# Altium schematic sheet Main.SchDoc
size A; SheetNumber: 2; SheetTotal: 5
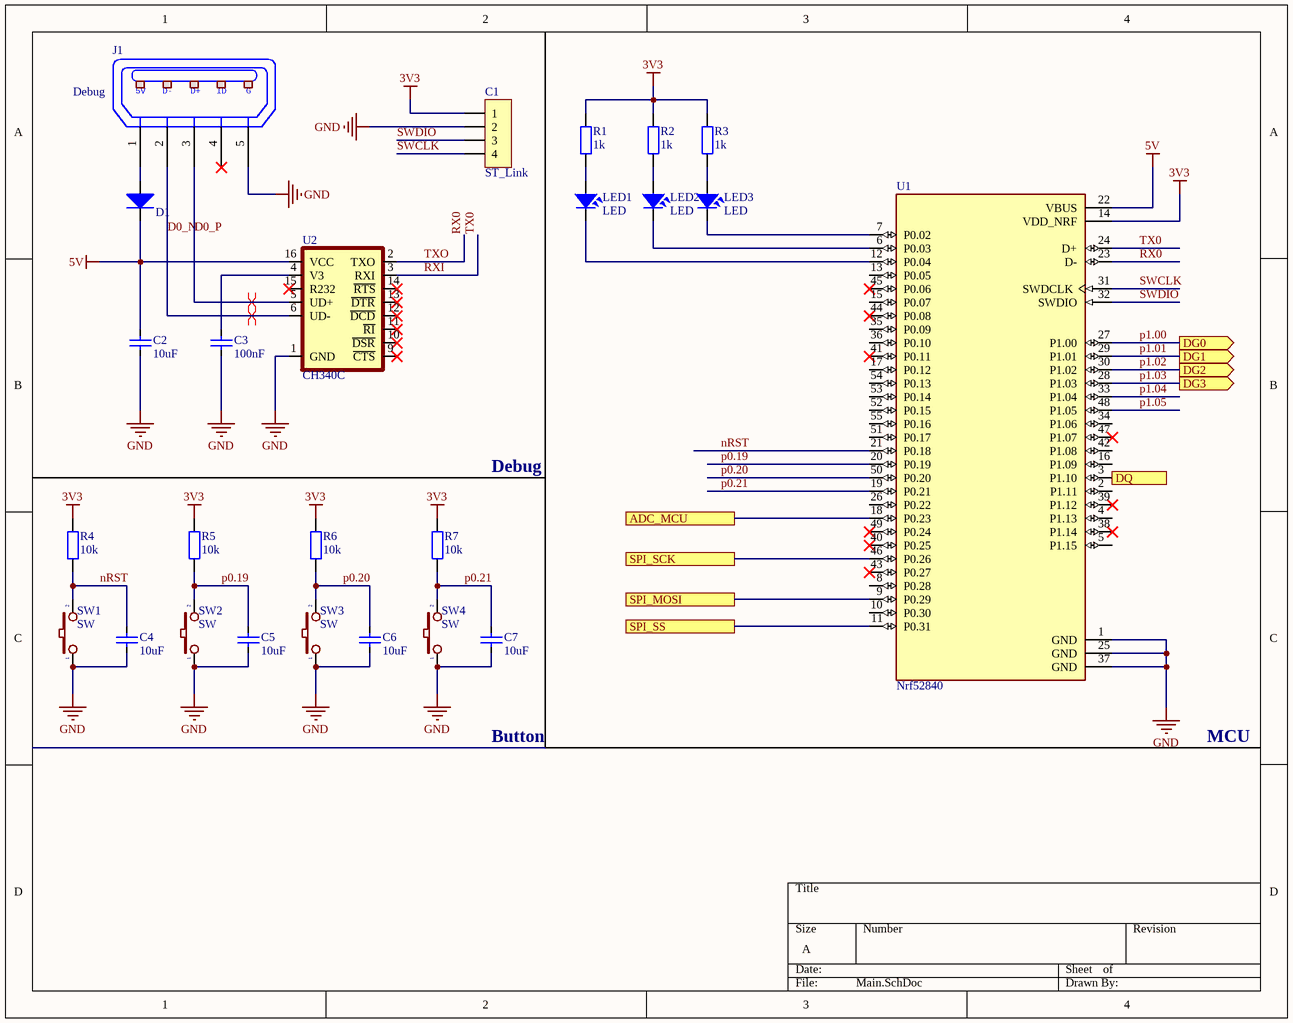
[diagram p0: Main.SchDoc]

## Parts
C1  ST_Link  [J4-D1T]
C2  10uF  [CAP_0805]
C3  100nF  [CAP_0805]
C4  10uF  [CAP_0805]
C5  10uF  [CAP_0805]
C6  10uF  [CAP_0805]
C7  10uF  [CAP_0805]
D1  Diode SMD  [DIO-214AC(SMA)]  (value not drawn)
J1  Debug  [USB-M1]
LED1  LED  [LED-0805-Red]
LED2  LED  [LED-0805-Yellow]
LED3  LED  [LED-0805-Green]
R1  1k  [RES-SMD-0805]
R2  1k  [RES-SMD-0805]
R3  1k  [RES-SMD-0805]
R4  10k  [RES-SMD-0805]
R5  10k  [RES-SMD-0805]
R6  10k  [RES-SMD-0805]
R7  10k  [RES-SMD-0805]
SW1  SW  [SW 3x2x4]
SW2  SW  [SW2]
SW3  SW  [SW2]
SW4  SW  [SW2]
U1  Nrf52840  [NRF52840]
U2  CH340C  [SOP-16]

## Ports
ADC_MCU, DG0 (out), DG1 (out), DG2 (out), DG3 (out), DQ, SPI_MOSI, SPI_SCK, SPI_SS

## Nets
3V3: C1.1 R1.1 R2.1 R3.1 R4.1 R5.1 R6.1 R7.1 U1.14(VDD_NRF)
5V: C2.2 D1.2(K) U1.22(VBUS) U2.16(VCC)
GND: C1.2 C2.1 C3.1 C4.1 C5.1 C6.1 C7.1 J1.5(P5) SW1.1 SW2.1 SW3.1 SW4.1 U1.1(GND) U1.25(GND) U1.37(GND) U2.1(GND)
ADC_MCU: U1.18(P0.23) ; port ADC_MCU
D0_N: J1.2(P2) U2.6(UD-)
D0_P: J1.3(P3) U2.5(UD+)
DQ: U1.3(P1.10) ; port DQ
nRST: C4.2 R4.2 SW1.2 U1.21(P0.18)
p0.19: C5.2 R5.2 SW2.2 U1.20(P0.19)
p0.20: C6.2 R6.2 SW3.2 U1.50(P0.20)
p0.21: C7.2 R7.2 SW4.2 U1.19(P0.21)
p1.00: U1.27(P1.00) ; port DG0
p1.01: U1.29(P1.01) ; port DG1
p1.02: U1.30(P1.02) ; port DG2
p1.03: U1.28(P1.03) ; port DG3
p1.04: U1.33(P1.04)
p1.05: U1.48(P1.05)
RX0: U1.23(D-) U2.2(TXO)  [also labelled TXO]
RXI: U1.24(D+) U2.3(RXI)  [also labelled TX0]
SPI_MOSI: U1.9(P0.29) ; port SPI_MOSI
SPI_SCK: U1.46(P0.26) ; port SPI_SCK
SPI_SS: U1.11(P0.31) ; port SPI_SS
SWCLK: C1.4 U1.31(SWDCLK)
SWDIO: C1.3 U1.32(SWDIO)
NetC3_2: C3.2 U2.4(V3)
NetD1_1: D1.1(A) J1.1(P1)
NetLED1_1: LED1.1 R1.2
NetLED1_2: LED1.2 U1.12(P0.04)
NetLED2_1: LED2.1 R2.2
NetLED2_2: LED2.2 U1.6(P0.03)
NetLED3_1: LED3.1 R3.2
NetLED3_2: LED3.2 U1.7(P0.02)

Not connected (* = marked no-connect by the designer): J1 4(P4)*; U1 2(P1.11) 4(P1.13) 5(P1.15) 8(P0.28) 10(P0.30) 13(P0.05) 15(P0.07) 16(P1.09) 17(P0.12) 26(P0.22) 34(P1.06) 35(P0.09) 36(P0.10) 38(P1.14)* 39(P1.12)* 40(P0.25)* 41(P0.11)* 42(P1.08) 43(P0.27)* 44(P0.08)* 45(P0.06)* 47(P1.07)* 49(P0.24)* 51(P0.17) 52(P0.15) 53(P0.14) 54(P0.13) 55(P0.16); U2 9(~{CTS})* 10(~{DSR})* 11(~{RI})* 12(~{DCD})* 13(~{DTR})* 14(~{RTS})* 15(R232)*

## Layout directives
differential pair: D0_N, D0_P

## Notes on the sheet
- Debug
- Button
- MCU
- (in symbol USB-5) 5V; D-; D+; ID; G

## Library data of the parts
C1 = JP4x1-2.0: WR-PHD 2.00 mm Socket Header; Manufacturer: W¨¹rth Elektronik eiSos GmbH; partNo: 62000411821; ComponentLink1 Description: Manufacturer; ComponentLink2 Description: Datasheet; NoPins: 04; Created Date: 2 April 2013; ComponentLink1URL: http://www.we-online.com; ComponentLink2URL: http://katalog.we-online.de/em/datasheet/6200xx11821.pdf; Created by: Karrer Zheng
C2-C7 = CapSMD: Capacitor; Value: 33p; Published: 8-Jun-2000; LatestRevisionDate: 17-Jul-2002; LatestRevisionNote: Re-released for DXP Platform.; PackageReference: RAD-0.3; Publisher: Altium Limited
D1 = Diode SMD: Default Diode; Code - JEDEC: DO-214-AB; Value: 1N5007; Published: 8-Jun-2000; Revision: July-2002: Re-released for DXP Platform.; Publisher: Altium Limited
J1 = USB-5: Manufacturer: FCI; Manufacturer Part Number: 10118193-0001LF; Connector Type: USB - micro B; Number of Contacts: 5; Gender: Receptacle; Specifications: USB 2.0; .Creator: MM; .Checked PCB: RF; Supplier 1: Digi-Key; RoHS: RoHS Compliant; Category: Connectors, Interconnects; Stock 1: 28642; Pricing 1: 1=0.46, 10=0.433, 25=0.3712, 50=0.3156, 100=0.3032, 250=0.27224, 500=0.25988 (USD); Packaging: Cut Tape (CT); Mounting Type: Surface Mount, Right Angle, Horizontal; Features: Shielded, Solder Retention; Ingress Protection: -; ComponentLink1URL: http://portal.fciconnect.com/Comergent//fci/drawing/10118193.pdf; ComponentLink1Description: http://portal.fciconnect.com/Comergent//fci/drawing/10118193.pdf; Supplier Part Number 1: 609-4616-1-ND; .Checked SCH: MM
LED1-LED3 = LED: LED Single colour Green and Red; Value: LED 3 ly Single Colour
R1-R7 = Resistor - SMD: Resistor SMD; Manufacturer: Generic Components; Class: Passive; Published: 08/06/2000; Publisher: Altium Hobart Technology Centre
SW1-SW4 = SW2: Switch button 2 pin; Value: SW chip 2 pin
U1 = Nrf52840: Module SoC
U2 = CH340C: USB to serial chip CH340; MF: WCH; Package: Package; Check_prices: https://www.snapeda.com/parts/CH340C/WCH/view-part/5428851/?ref=eda; Value: *; Price: None; MP: CH340C; Availability: Unavailable; SnapEDA_Link: https://www.snapeda.com/parts/CH340C/WCH/view-part/5428851/?ref=snap